# Altium schematic sheet dsi_csi.SchDoc
size A4
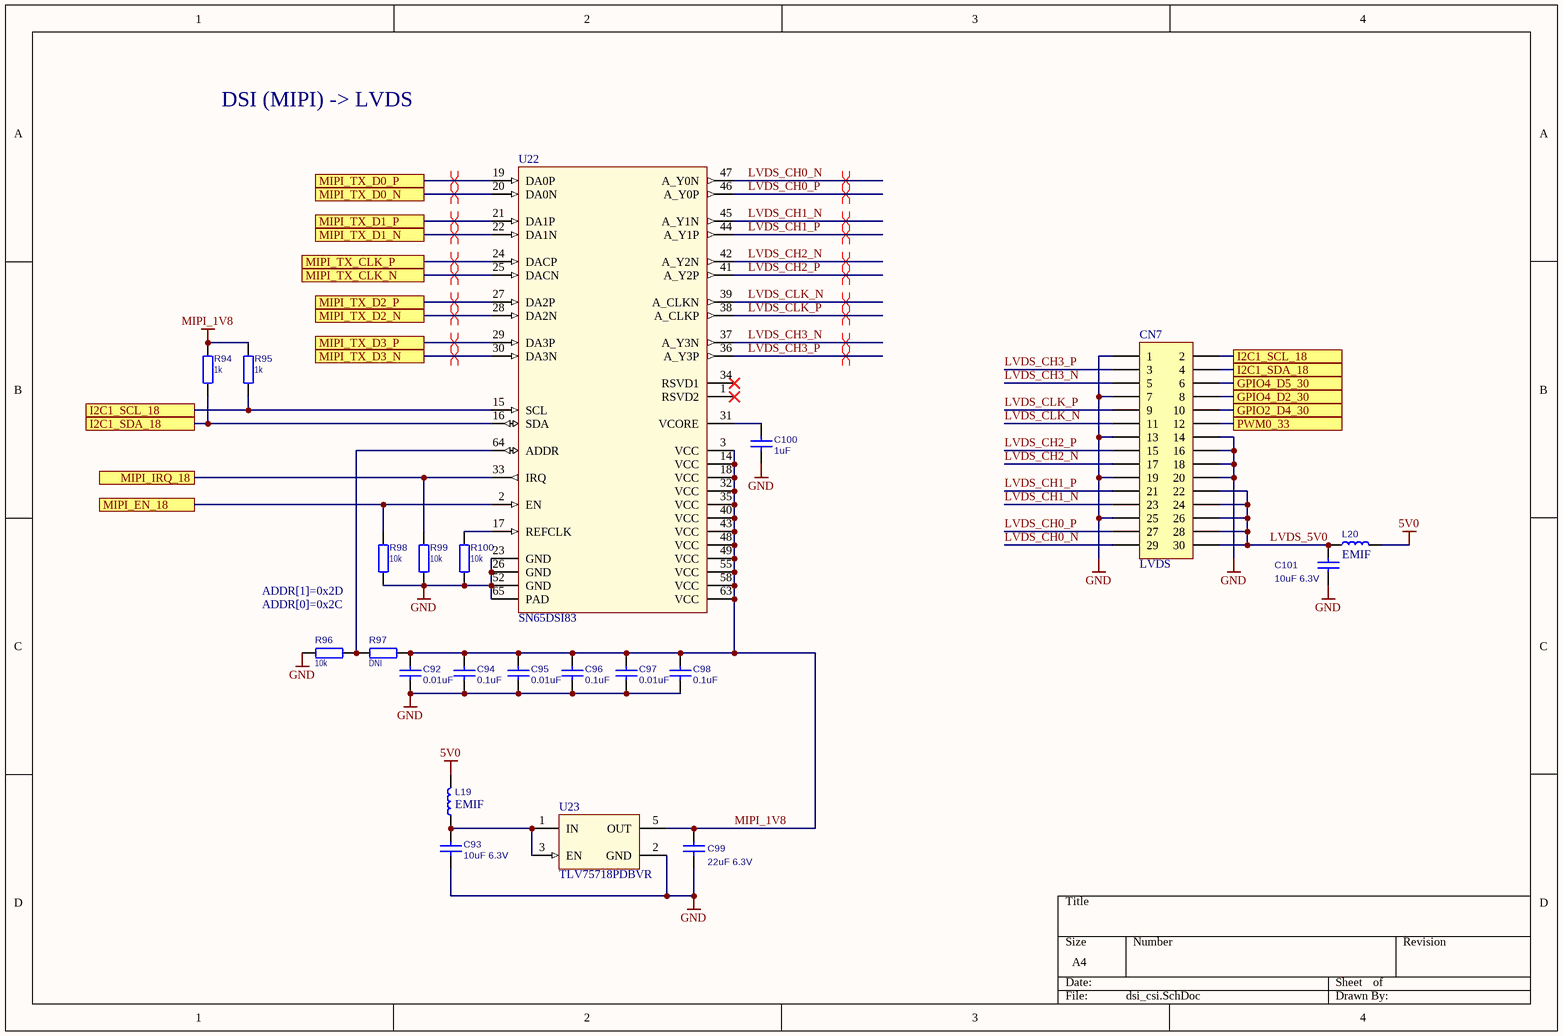
[diagram p0: dsi_csi.SchDoc]

## Parts
C92  value 0.01uF  [C0603]  (hidden comment: CL10B103KB8NNNC)
C93  value 10uF 6.3V  [C0603]  (hidden comment: CC0603MRX5R5BB106)
C94  value 0.1uF  [C0603]  (hidden comment: C1608X7R1H104K080AA)
C95  value 0.01uF  [C0603]  (hidden comment: CL10B103KB8NNNC)
C96  value 0.1uF  [C0603]  (hidden comment: C1608X7R1H104K080AA)
C97  value 0.01uF  [C0603]  (hidden comment: CL10B103KB8NNNC)
C98  value 0.1uF  [C0603]  (hidden comment: C1608X7R1H104K080AA)
C99  value 22uF 6.3V  [C0805]  (hidden comment: CL21A226MQQNNNE)
C100  value 1uF  [C0603]  (hidden comment: GRM188R61H105KAALD)
C101  value 10uF 6.3V  [C0603]  (hidden comment: CC0603MRX5R5BB106)
CN7  LVDS  [DF13EA-30DP-1.25V]
L19  value EMIF  [IND0603]  (hidden comment: BLM18AG102SN1D)
L20  value EMIF  [IND0805]  (hidden comment: BLM21PG221SN1D)
R94  1k  [R0603]
R95  1k  [R0603]
R96  10k  [R0603]
R97  DNI  [R0603]
R98  10k  [R0603]
R99  10k  [R0603]
R100  10k  [R0603]
U22  SN65DSI83  [HPM064_N]
U23  TLV75718PDBVR  [SOT-23-5]

## Ports
GPIO2_D4_30, GPIO4_D2_30, GPIO4_D5_30, I2C1_SCL_18, I2C1_SDA_18, MIPI_EN_18, MIPI_IRQ_18, MIPI_TX_CLK_N, MIPI_TX_CLK_P, MIPI_TX_D0_N, MIPI_TX_D0_P, MIPI_TX_D1_N, MIPI_TX_D1_P, MIPI_TX_D2_N, MIPI_TX_D2_P, MIPI_TX_D3_N, MIPI_TX_D3_P, PWM0_33

## Nets
5V0: L19.2 L20.1
GND: C92.2 C93.2 C94.1 C95.2 C96.1 C97.2 C98.1 C99.1 C100.1 C101.2 CN7.1 CN7.7 CN7.13 CN7.14 CN7.16 CN7.18 CN7.19 CN7.20 CN7.25 R96.1 R98.1 R99.1 R100.1 U22.23(GND) U22.26(GND) U22.52(GND) U22.65(PAD) U23.2(GND)
MIPI_1V8: C92.1 C94.2 C95.1 C96.2 C97.1 C98.2 C99.2 R94.1 R95.1 R97.2 U22.3(VCC) U22.14(VCC) U22.18(VCC) U22.32(VCC) U22.35(VCC) U22.40(VCC) U22.43(VCC) U22.48(VCC) U22.49(VCC) U22.55(VCC) U22.58(VCC) U22.63(VCC) U23.5(OUT)
GPIO2_D4_30: CN7.10 ; port GPIO2_D4_30
GPIO4_D2_30: CN7.8 ; port GPIO4_D2_30
GPIO4_D5_30: CN7.6 ; port GPIO4_D5_30
I2C1_SCL_18: CN7.2 R95.2 U22.15(SCL) ; port I2C1_SCL_18
I2C1_SDA_18: CN7.4 R94.2 U22.16(SDA) ; port I2C1_SDA_18
LVDS_5V0: C101.1 CN7.22 CN7.24 CN7.26 CN7.28 CN7.30 L20.2
LVDS_CH0_N: CN7.29 U22.47(A_Y0N)
LVDS_CH0_P: CN7.27 U22.46(A_Y0P)
LVDS_CH1_N: CN7.23 U22.45(A_Y1N)
LVDS_CH1_P: CN7.21 U22.44(A_Y1P)
LVDS_CH2_N: CN7.17 U22.42(A_Y2N)
LVDS_CH2_P: CN7.15 U22.41(A_Y2P)
LVDS_CH3_N: CN7.5 U22.37(A_Y3N)
LVDS_CH3_P: CN7.3 U22.36(A_Y3P)
LVDS_CLK_N: CN7.11 U22.39(A_CLKN)
LVDS_CLK_P: CN7.9 U22.38(A_CLKP)
MIPI_EN_18: R98.2 U22.2(EN) ; port MIPI_EN_18
MIPI_IRQ_18: R99.2 U22.33(IRQ) ; port MIPI_IRQ_18
MIPI_TX_CLK_N: U22.25(DACN) ; port MIPI_TX_CLK_N
MIPI_TX_CLK_P: U22.24(DACP) ; port MIPI_TX_CLK_P
MIPI_TX_D0_N: U22.20(DA0N) ; port MIPI_TX_D0_N
MIPI_TX_D0_P: U22.19(DA0P) ; port MIPI_TX_D0_P
MIPI_TX_D1_N: U22.22(DA1N) ; port MIPI_TX_D1_N
MIPI_TX_D1_P: U22.21(DA1P) ; port MIPI_TX_D1_P
MIPI_TX_D2_N: U22.28(DA2N) ; port MIPI_TX_D2_N
MIPI_TX_D2_P: U22.27(DA2P) ; port MIPI_TX_D2_P
MIPI_TX_D3_N: U22.30(DA3N) ; port MIPI_TX_D3_N
MIPI_TX_D3_P: U22.29(DA3P) ; port MIPI_TX_D3_P
PWM0_33: CN7.12 ; port PWM0_33
NetC93_1: C93.1 L19.1 U23.1(IN) U23.3(EN)
NetC100_2: C100.2 U22.31(VCORE)
NetR96_2: R96.2 R97.1 U22.64(ADDR)
NetR100_2: R100.2 U22.17(REFCLK)

Not connected (* = marked no-connect by the designer): U22 1(RSVD2)* 34(RSVD1)*

## Layout directives
differential pair: LVDS_CH0_N, LVDS_CH0_P, LVDS_CH1_N, LVDS_CH1_P, LVDS_CH2_N, LVDS_CH2_P, LVDS_CH3_N, LVDS_CH3_P, LVDS_CLK_N, LVDS_CLK_P, MIPI_TX_CLK_N, MIPI_TX_CLK_P, MIPI_TX_D0_N, MIPI_TX_D0_P, MIPI_TX_D1_N, MIPI_TX_D1_P, MIPI_TX_D2_N, MIPI_TX_D2_P, MIPI_TX_D3_N, MIPI_TX_D3_P

## Notes on the sheet
- DSI (MIPI) -> LVDS
- ADDR[1]=0x2D
- ADDR[0]=0x2C

## Library data of the parts
C92-C101 = CAP_NPOL
CN7 = HDR 15X2: Header, 15-Pin, Dual row; LatestRevisionDate: 17-Jul-2002; LatestRevisionNote: Re-released for DXP Platform.; Publisher: Altium Limited
L19 L20 = IND_WO_IRON
R94-R100 = RESISTOR: RES
  R94 R95: Value: 1k
  R96 R98-R100: Value: 10k
  R97: Value: DNI
U22 = SN65DSI83: Single-Channel MIPI® DSI to Single-Link LVDS Bridge; value: SN65DSI83
U23 = TLV733P: Capacitor-Free, 300-mA, Low-Dropout Regulator with Foldback Current Limit for Portable Devices; value: TLV733P